# EAGLE schematic tulip breakout (EAGLE 9.6.2)
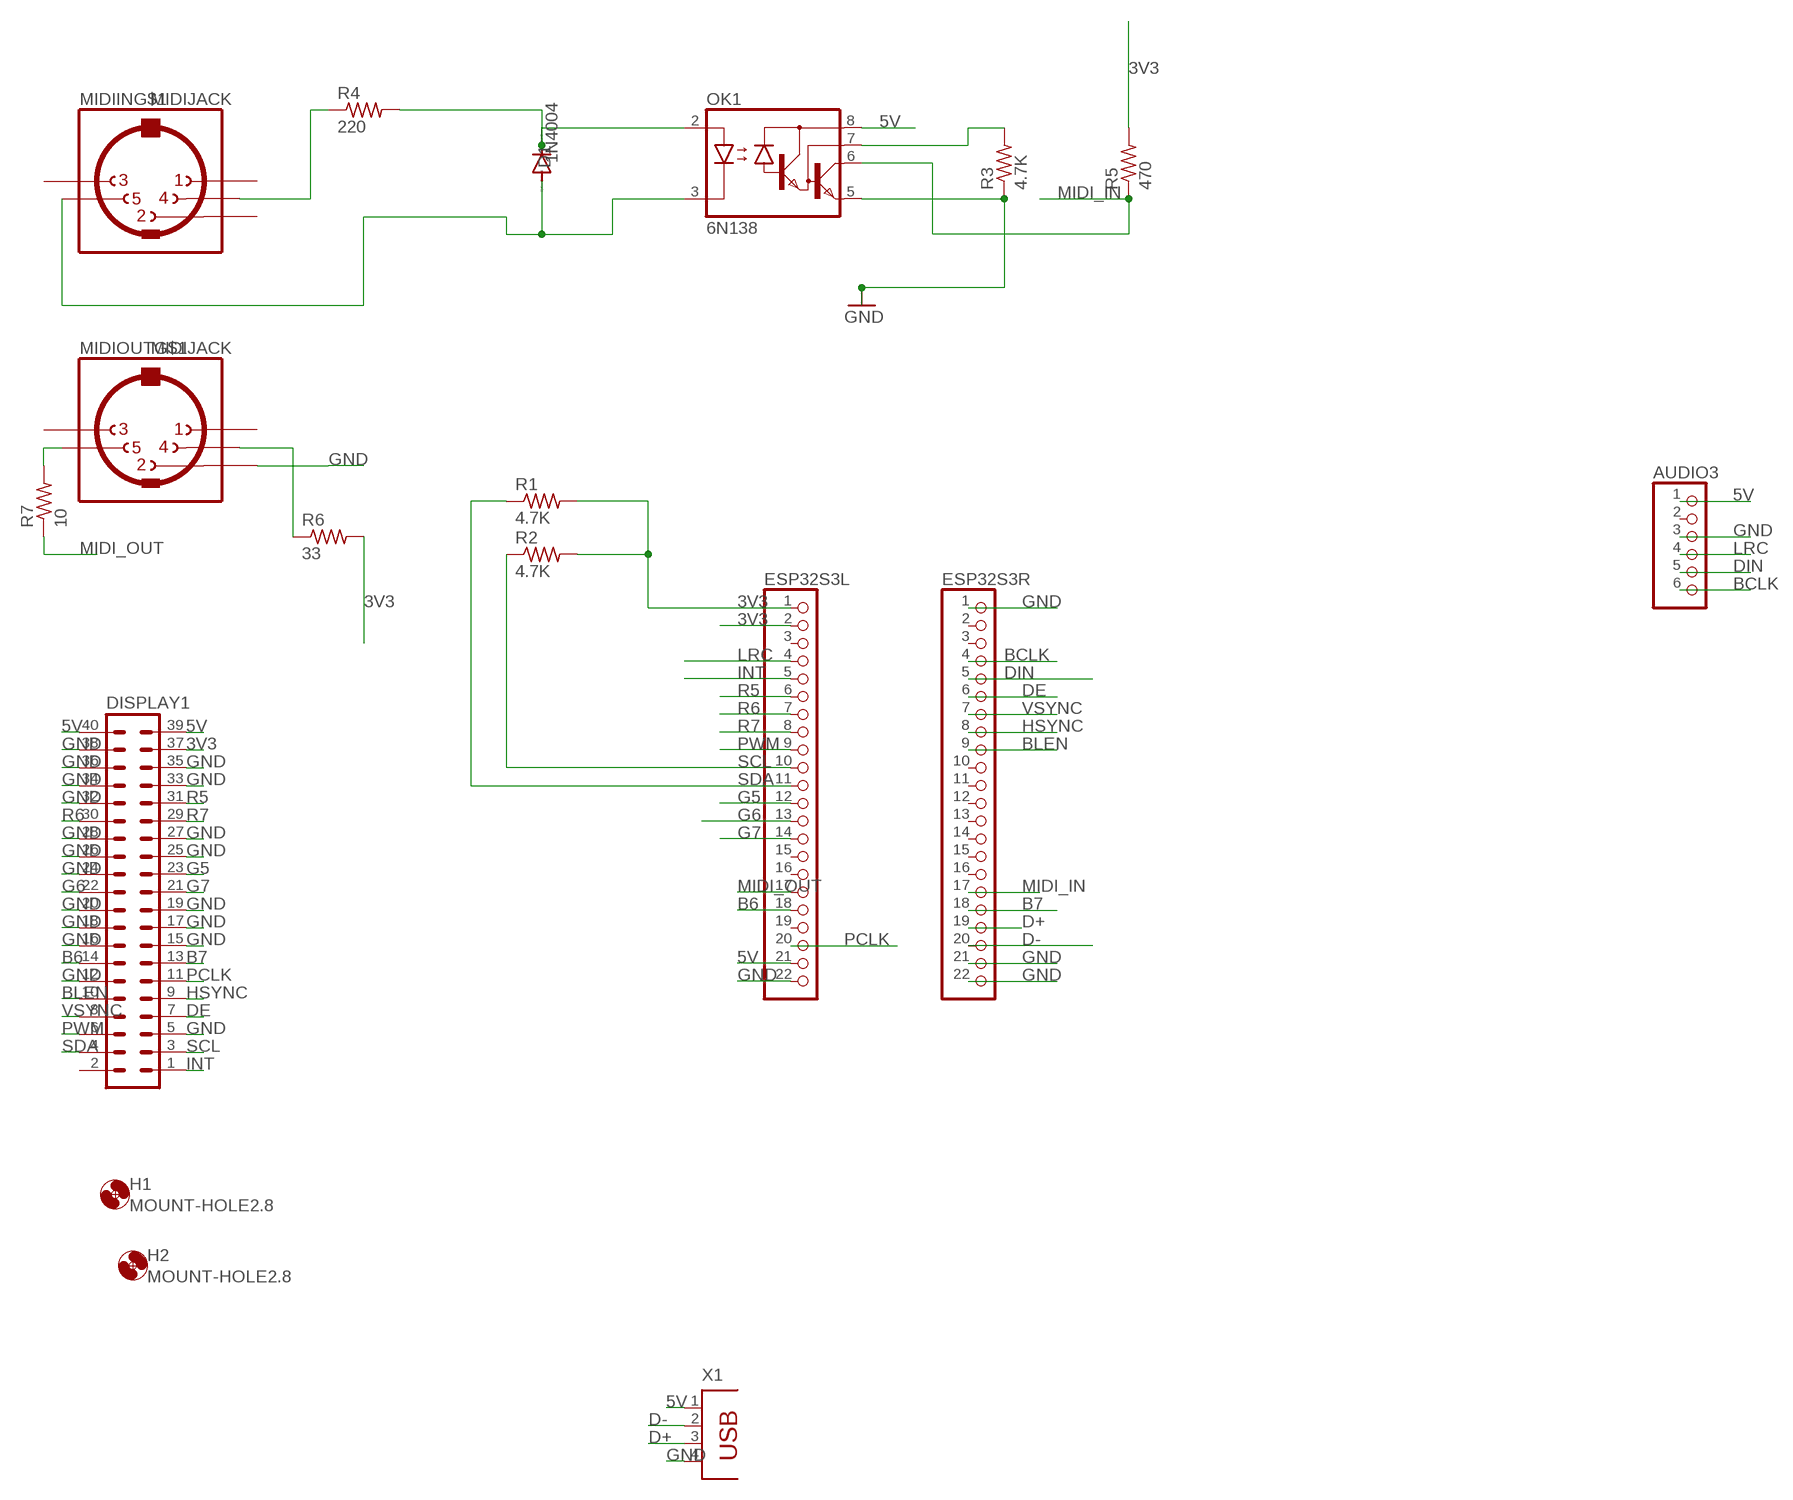
[diagram p0: schematic, sheet 1]

## Parts
AUDIO3  PINHD-1X6  [1X06]
D1  1N4004  [DO41-10]
DISPLAY1  MA20-2  [MA20-2]
ESP32S3L  PINHD-1X22  [1X22]
ESP32S3R  PINHD-1X22  [1X22]
H1  MOUNT-HOLE2.8  [2,8]
H2  MOUNT-HOLE2.8  [2,8]
MIDIIN  MIDIJACK  [CP-2350]
MIDIOUT  MIDIJACK  [CP-2350]
OK1  6N138  [DIL08]
R1  4.7K  R-US_0207/12  [0207/12]
R2  4.7K  R-US_0207/12  [0207/12]
R3  4.7K  R-US_0207/12  [0207/12]
R4  220  R-US_0207/12  [0207/12]
R5  470  R-US_0207/12  [0207/12]
R6  33  R-US_0207/12  [0207/12]
R7  10  R-US_0207/12  [0207/12]
X1  PN87520  [PN87520]

## Nets
3V3: DISPLAY1.37 ESP32S3L.1 ESP32S3L.2 R1.2 R2.2 R5.2 R6.2
5V: AUDIO3.1 DISPLAY1.39 DISPLAY1.40 ESP32S3L.21 OK1.8(VCC) X1.1
B6: DISPLAY1.14 ESP32S3L.18
B7: DISPLAY1.13 ESP32S3R.18
BCLK: AUDIO3.6 ESP32S3R.4
BLEN: DISPLAY1.10 ESP32S3R.9
D+: ESP32S3R.19 X1.3
D-: ESP32S3R.20 X1.2
DE: DISPLAY1.7 ESP32S3R.6
DIN: AUDIO3.5 ESP32S3R.5
G5: DISPLAY1.23 ESP32S3L.12
G6: DISPLAY1.22 ESP32S3L.13
G7: DISPLAY1.21 ESP32S3L.14
GND: AUDIO3.3 DISPLAY1.5 DISPLAY1.12 DISPLAY1.15 DISPLAY1.16 DISPLAY1.17 DISPLAY1.18 DISPLAY1.19 DISPLAY1.20 DISPLAY1.24 DISPLAY1.25 DISPLAY1.26 DISPLAY1.27 DISPLAY1.28 DISPLAY1.32 DISPLAY1.33 DISPLAY1.34 DISPLAY1.35 DISPLAY1.36 DISPLAY1.38 ESP32S3L.22 ESP32S3R.1 ESP32S3R.21 ESP32S3R.22 MIDIOUT.2 OK1.5(GND) R3.1 X1.4
HSYNC: DISPLAY1.9 ESP32S3R.8
INT: DISPLAY1.1 ESP32S3L.5
LRC: AUDIO3.4 ESP32S3L.4
MIDI_IN: ESP32S3R.17 OK1.6(VO) R5.1
MIDI_OUT: ESP32S3L.17 R7.1
N$29: MIDIIN.4 R4.1
N$30: D1.C OK1.2(A) R4.2
N$31: D1.A MIDIIN.5 OK1.3(C)
N$32: OK1.7(VB) R3.2
N$34: MIDIOUT.5 R7.2
N$35: MIDIOUT.4 R6.1
PCLK: DISPLAY1.11 ESP32S3L.20
PWM: DISPLAY1.6 ESP32S3L.9
R5: DISPLAY1.31 ESP32S3L.6
R6: DISPLAY1.30 ESP32S3L.7
R7: DISPLAY1.29 ESP32S3L.8
SCL: DISPLAY1.3 ESP32S3L.10 R2.1
SDA: DISPLAY1.4 ESP32S3L.11 R1.1
VSYNC: DISPLAY1.8 ESP32S3R.7
Unconnected: AUDIO3.2 DISPLAY1.2 ESP32S3L.3 ESP32S3L.15 ESP32S3L.16 ESP32S3L.19 ESP32S3R.2 ESP32S3R.3 ESP32S3R.10 ESP32S3R.11 ESP32S3R.12 ESP32S3R.13 ESP32S3R.14 ESP32S3R.15 ESP32S3R.16 MIDIIN.1 MIDIIN.2 MIDIIN.3 MIDIIN.PE1(MT) MIDIIN.PE2(MT) MIDIIN.PE(MT) MIDIIN.PE@(MT) MIDIOUT.1 MIDIOUT.3 MIDIOUT.PE1(MT) MIDIOUT.PE2(MT) MIDIOUT.PE(MT) MIDIOUT.PE@(MT)

## Library data of the parts
AUDIO3 = pinhead:PINHD-1X6: PIN HEADER
D1 = diode:1N4004: DIODE general purpose rectifier, 1 A
DISPLAY1 = con-lstb:MA20-2: PIN HEADER; OC_FARNELL: unknown; OC_NEWARK: unknown
ESP32S3L ESP32S3R = pinhead:PINHD-1X22: PIN HEADER
H1 H2 = holes:MOUNT-HOLE: MOUNTING HOLE with drill center marker
MIDIIN MIDIOUT = adafruit:MIDIJACK: DIN 5 jack also known as MIDI jack A modification of conn-hirshman:MAB5SH with two options for the grounding 'teeth'
OK1 = optocoupler:6N138: MOTOROLA OPTO COUPLER; MF: VISHAY/TELEFUNKEN; MPN: 6N138; OC_FARNELL: 9860150; OC_NEWARK: 35K5294
R1-R7 = rcl:R-US_: RESISTOR, American symbol; SPICEPREFIX: R
X1 = con-berg:PN87520: BERG USB connector; OC_FARNELL: unknown; OC_NEWARK: unknown